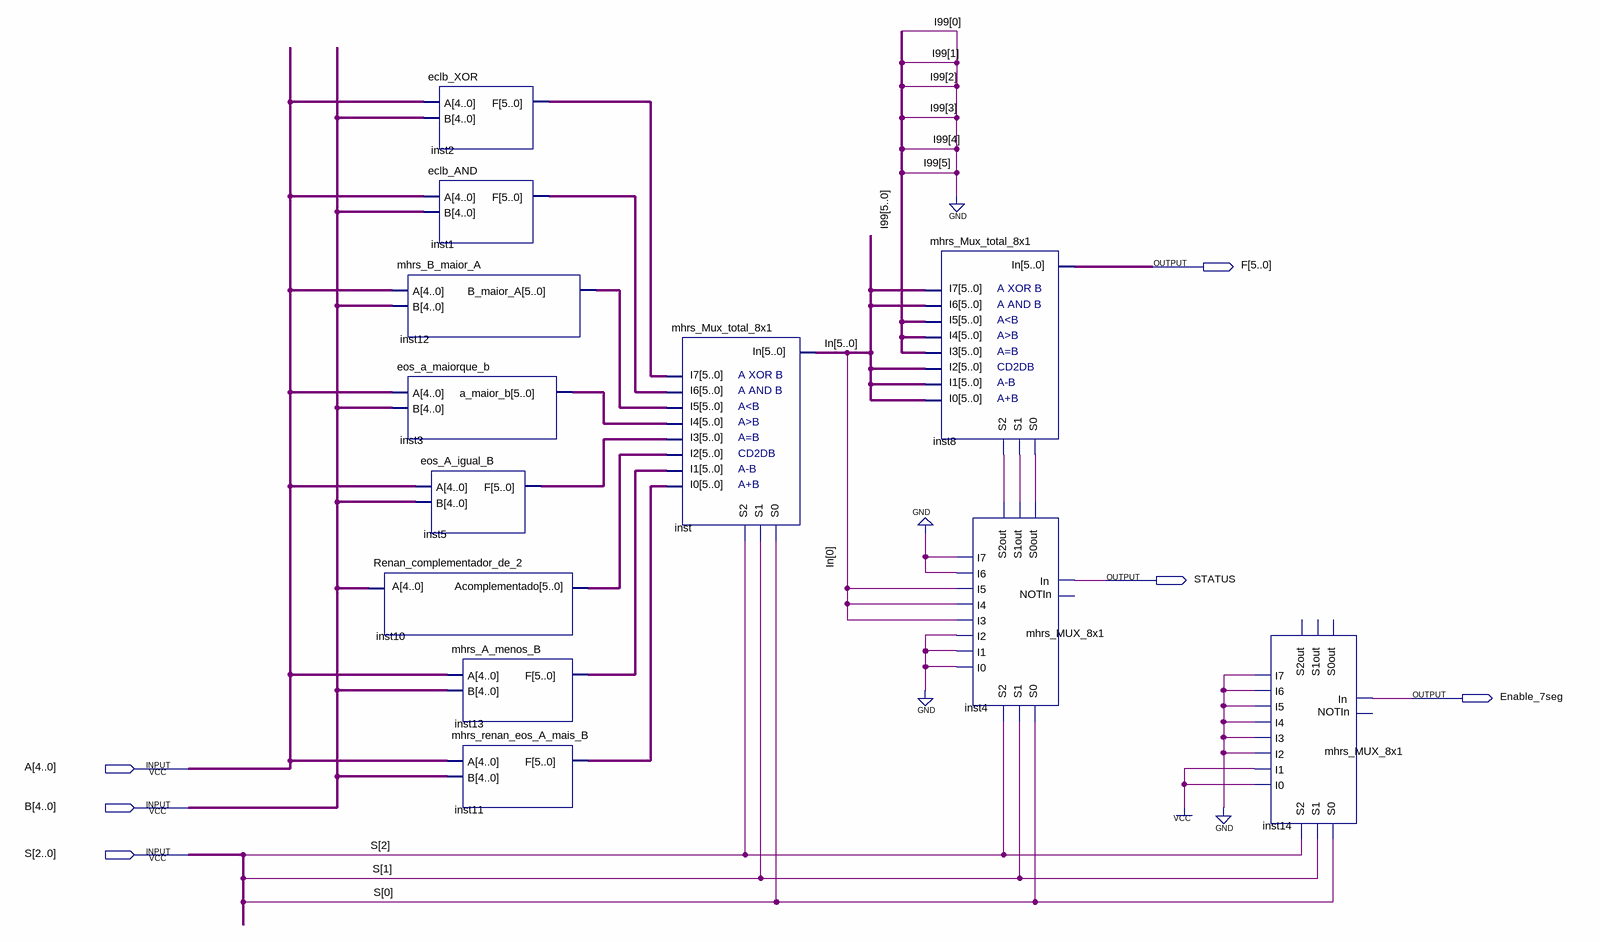
[diagram p0: schematic sheet]
// Quartus schematic Projeto_Quartus.bdf as structural Verilog: 12 symbols, 6 pins
module Projeto_Quartus (
  input  [4:0] A,
  input  [4:0] B,
  input  [2:0] S,
  output [5:0] F,
  output STATUS,
  output Enable_7seg
);

  wire inst4_s0out, inst4_s1out, inst4_s2out;
  wire [5:0] In, inst1_f, inst2_f, inst3_a_maior_b, inst5_f, inst10_acomplementado, inst11_f,
       inst12_b_maior_a, inst13_f;

  mhrs_B_maior_A inst12 (.A(A), .B(B), .B_maior_A(inst12_b_maior_a));
  eos_a_maiorque_b inst3 (.A(A), .B(B), .a_maior_b(inst3_a_maior_b));
  Renan_complementador_de_2 inst10 (.A(B), .Acomplementado(inst10_acomplementado));
  eclb_XOR inst2 (.A(A), .B(B), .F(inst2_f));
  eclb_AND inst1 (.A(A), .B(B), .F(inst1_f));
  eos_A_igual_B inst5 (.A(A), .B(B), .F(inst5_f));
  mhrs_A_menos_B inst13 (.A(A), .B(B), .F(inst13_f));
  mhrs_renan_eos_A_mais_B inst11 (.A(A), .B(B), .F(inst11_f));
  mhrs_Mux_total_8x1 inst (
    .S2(S[2]), .S1(S[1]), .S0(S[0]), .I7(inst2_f), .I6(inst1_f), .I5(inst12_b_maior_a), .I4(inst3_a_maior_b),
    .I3(inst5_f), .I2(inst10_acomplementado), .I1(inst13_f), .I0(inst11_f), .In(In));
  mhrs_Mux_total_8x1 inst8 (
    .S2(inst4_s2out), .S1(inst4_s1out), .S0(inst4_s0out), .I7(In), .I6(In), .I5({6{1'b0}}), .I4({6{1'b0}}),
    .I3({6{1'b0}}), .I2(In), .I1(In), .I0(In), .In(F));
  mhrs_MUX_8x1 inst4 (
    .S2(S[2]), .S1(S[1]), .S0(S[0]), .I7(1'b0), .I6(1'b0), .I5(In[0]), .I4(In[0]), .I3(In[0]), .I2(1'b0),
    .I1(1'b0), .I0(1'b0), .S2out(inst4_s2out), .S1out(inst4_s1out), .S0out(inst4_s0out), .In(STATUS));  // open: NOTIn
  mhrs_MUX_8x1 inst14 (
    .S2(S[2]), .S1(S[1]), .S0(S[0]), .I7(1'b0), .I6(1'b0), .I5(1'b0), .I4(1'b0), .I3(1'b0), .I2(1'b0),
    .I1(1'b1), .I0(1'b1), .In(Enable_7seg));  // open: S2out, S1out, S0out, NOTIn
endmodule
